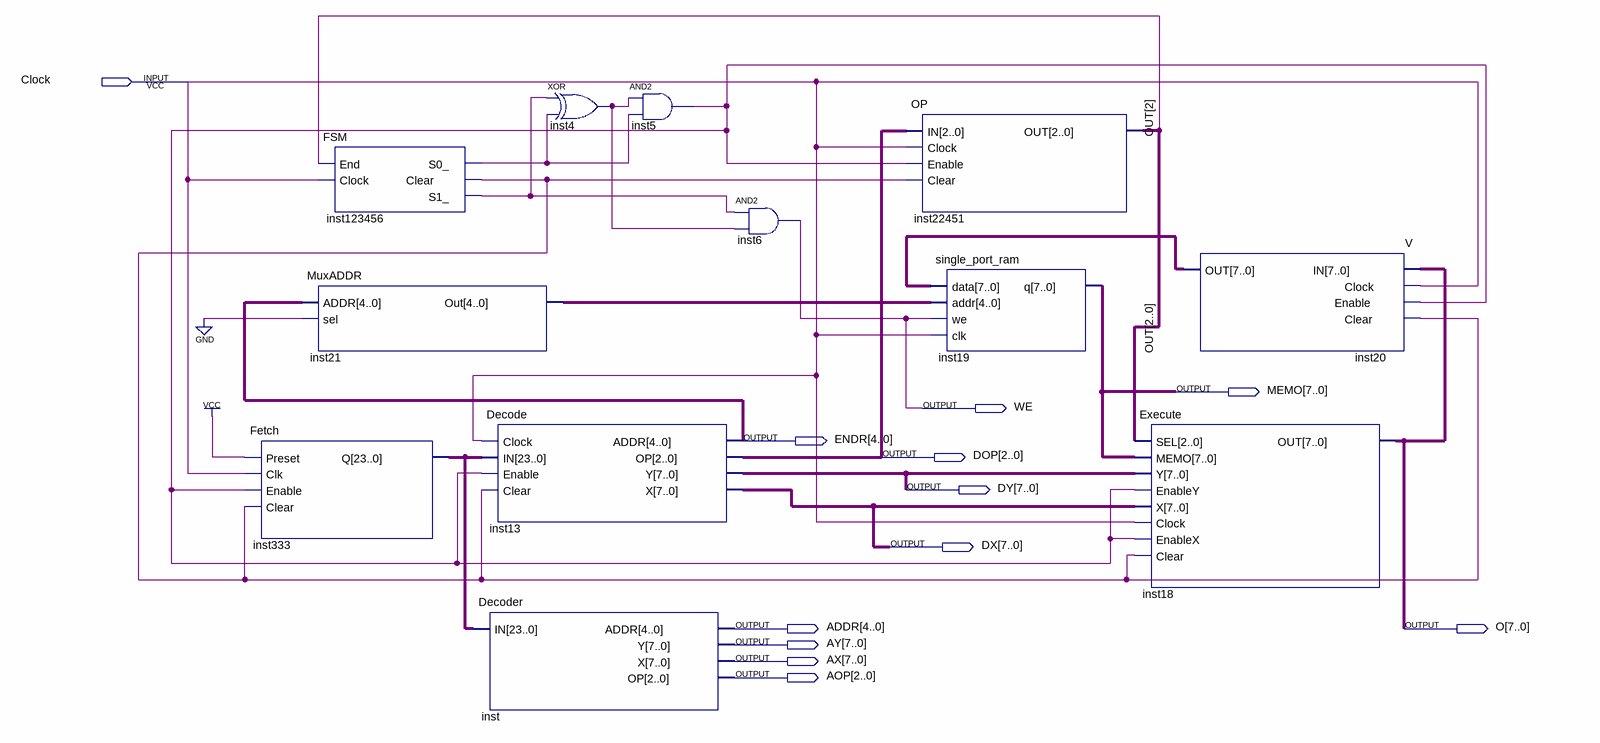
[diagram p0: schematic sheet]
// Quartus schematic Nibble.bdf as structural Verilog: 12 symbols, 12 pins
module Nibble (
  input  Clock,
  output [7:0] MEMO,
  output WE,
  output [4:0] ENDR,
  output [2:0] DOP,
  output [7:0] DY,
  output [7:0] DX,
  output [4:0] ADDR,
  output [7:0] O,
  output [7:0] AY,
  output [7:0] AX,
  output [2:0] AOP
);

  wire inst4_out, inst5_out, inst123456_clear, inst123456_s0_, inst123456_s1_;
  wire [2:0] OUT;
  wire [4:0] inst21_out;
  wire [7:0] inst20_out;
  wire [23:0] inst333_q;

  MuxADDR inst21 (.ADDR(ENDR), .sel(1'b0), .Out(inst21_out));
  Fetch inst333 (.Preset(1'b1), .Clk(Clock), .Enable(inst5_out), .Clear(inst123456_clear), .Q(inst333_q));
  FSM inst123456 (.End(OUT[2]), .Clock(Clock), .S0_(inst123456_s0_), .Clear(inst123456_clear), .S1_(inst123456_s1_));
  Decode inst13 (
    .Clock(Clock), .IN(inst333_q), .Enable(inst5_out), .Clear(inst123456_clear), .ADDR(ENDR), .OP(DOP),
    .Y(DY), .X(DX));
  Decoder inst (.IN(inst333_q), .ADDR(ADDR), .Y(AY), .X(AX), .OP(AOP));
  xor inst4 (inst4_out, inst123456_s1_, inst123456_s0_);
  and inst5 (inst5_out, inst4_out, inst123456_s0_);
  and inst6 (WE, inst123456_s1_, inst4_out);
  OP inst22451 (.IN(DOP), .Clock(Clock), .Enable(inst5_out), .Clear(inst123456_clear), .OUT(OUT));
  single_port_ram inst19 (.data(inst20_out), .addr(inst21_out), .we(WE), .clk(Clock), .q(MEMO));
  Execute inst18 (
    .SEL(OUT), .MEMO(MEMO), .Y(DY), .EnableY(inst5_out), .X(DX), .Clock(Clock), .EnableX(inst5_out),
    .Clear(inst123456_clear), .OUT(O));
  V inst20 (.IN(O), .Clock(Clock), .Enable(inst5_out), .Clear(inst123456_clear), .OUT(inst20_out));
endmodule
